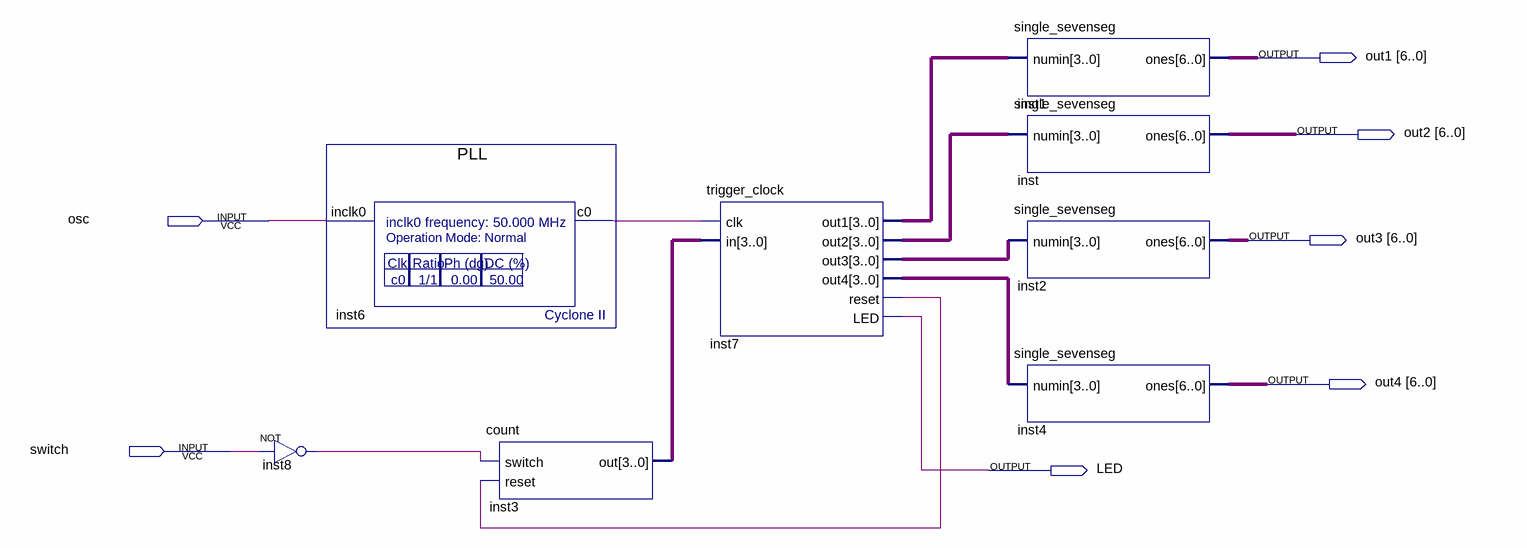
[diagram p0: schematic sheet]
// Quartus schematic TimeBinCount_Separate.bdf as structural Verilog: 8 symbols, 7 pins
module TimeBinCount_Separate (
  input  osc,
  input  switch,
  output [6:0] out1,
  output [6:0] out2,
  output [6:0] out3,
  output [6:0] out4,
  output LED
);

  wire inst6_c0, inst7_reset, inst8_out;
  wire [3:0] inst3_out, inst7_out1, inst7_out2, inst7_out3, inst7_out4;

  not inst8 (inst8_out, switch);
  PLL inst6 (.inclk0(osc), .c0(inst6_c0));
  count inst3 (.switch(inst8_out), .reset(inst7_reset), .out(inst3_out));
  trigger_clock inst7 (
    .clk(inst6_c0), .in(inst3_out), .out1(inst7_out1), .out2(inst7_out2), .out3(inst7_out3),
    .out4(inst7_out4), .reset(inst7_reset), .LED(LED));
  single_sevenseg inst1 (.numin(inst7_out1), .ones(out1));
  single_sevenseg inst (.numin(inst7_out2), .ones(out2));
  single_sevenseg inst2 (.numin(inst7_out3), .ones(out3));
  single_sevenseg inst4 (.numin(inst7_out4), .ones(out4));
endmodule
